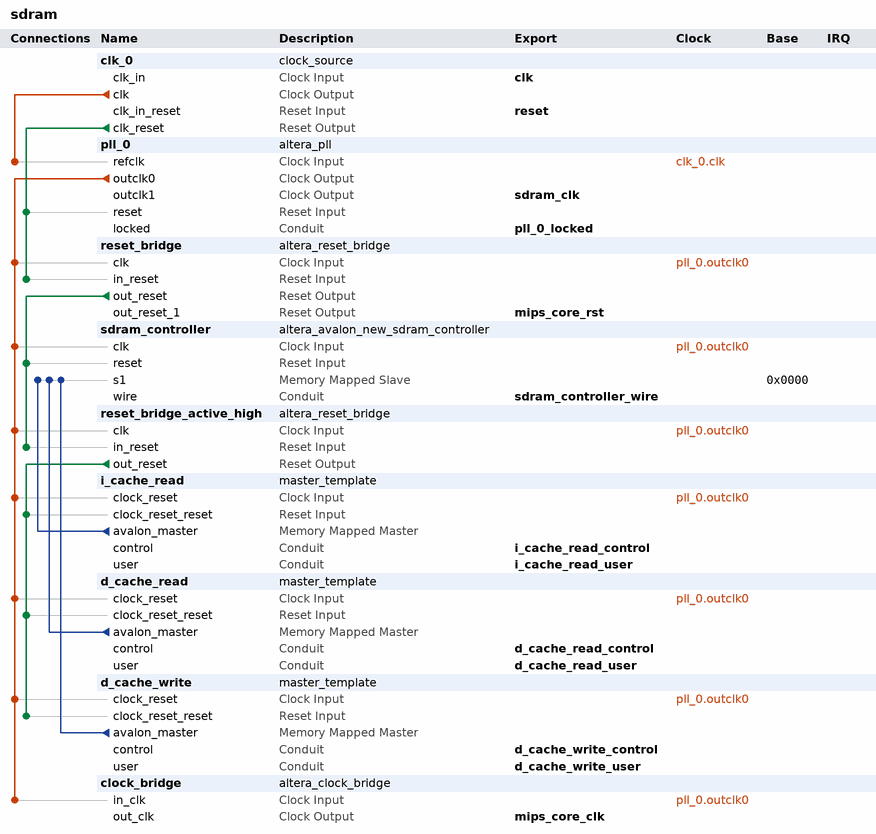
[diagram p0: system contents]
# Platform Designer (Qsys) system sdram, Cyclone V 5CSEMA5F31C6
# Parameters at their usual value, and those the tool derives, are not listed.
package require -exact qsys 19.1
create_system sdram
set_project_property DEVICE_FAMILY {Cyclone V}
set_project_property DEVICE 5CSEMA5F31C6

add_instance clk_0 clock_source 19.1
set_instance_parameter_value clk_0 clockFrequency 50000000

add_instance pll_0 altera_pll 19.1
set_instance_parameter_value pll_0 gui_actual_phase_shift1 {-3059 ps}
set_instance_parameter_value pll_0 gui_device_speed_grade 2
set_instance_parameter_value pll_0 gui_number_of_clocks 2
set_instance_parameter_value pll_0 gui_operation_mode normal
set_instance_parameter_value pll_0 gui_output_clock_frequency0 100.0
set_instance_parameter_value pll_0 gui_output_clock_frequency1 100.0
set_instance_parameter_value pll_0 gui_pll_mode {Integer-N PLL}
set_instance_parameter_value pll_0 gui_reference_clock_frequency 50.0
set_instance_parameter_value pll_0 gui_use_locked true

add_instance reset_bridge altera_reset_bridge 19.1
set_instance_parameter_value reset_bridge ACTIVE_LOW_RESET 1
set_instance_parameter_value reset_bridge NUM_RESET_OUTPUTS 2
set_instance_parameter_value reset_bridge SYNCHRONOUS_EDGES deassert

add_instance sdram_controller altera_avalon_new_sdram_controller 19.1
set_instance_parameter_value sdram_controller TAC 5.4
set_instance_parameter_value sdram_controller TRCD 15.0
set_instance_parameter_value sdram_controller TRP 15.0
set_instance_parameter_value sdram_controller casLatency 3
set_instance_parameter_value sdram_controller columnWidth 10
set_instance_parameter_value sdram_controller dataWidth 16
set_instance_parameter_value sdram_controller generateSimulationModel true
set_instance_parameter_value sdram_controller model single_Micron_MT48LC4M32B2_7_chip
set_instance_parameter_value sdram_controller numberOfBanks 4
set_instance_parameter_value sdram_controller numberOfChipSelects 1
set_instance_parameter_value sdram_controller powerUpDelay 1.0
set_instance_parameter_value sdram_controller refreshPeriod 7.8125
set_instance_parameter_value sdram_controller rowWidth 13

add_instance reset_bridge_active_high altera_reset_bridge 19.1
set_instance_parameter_value reset_bridge_active_high ACTIVE_LOW_RESET 0
set_instance_parameter_value reset_bridge_active_high SYNCHRONOUS_EDGES deassert

add_instance i_cache_read master_template 1.0
set_instance_parameter_value i_cache_read ADDRESS_WIDTH 26
set_instance_parameter_value i_cache_read BURST_CAPABLE 0
set_instance_parameter_value i_cache_read DATA_WIDTH 32
set_instance_parameter_value i_cache_read FIFO_DEPTH 32
set_instance_parameter_value i_cache_read MASTER_DIRECTION 0
set_instance_parameter_value i_cache_read MAXIMUM_BURST_COUNT 2
set_instance_parameter_value i_cache_read MEMORY_BASED_FIFO 1

add_instance d_cache_read master_template 1.0
set_instance_parameter_value d_cache_read ADDRESS_WIDTH 26
set_instance_parameter_value d_cache_read BURST_CAPABLE 0
set_instance_parameter_value d_cache_read DATA_WIDTH 32
set_instance_parameter_value d_cache_read FIFO_DEPTH 32
set_instance_parameter_value d_cache_read MASTER_DIRECTION 0
set_instance_parameter_value d_cache_read MAXIMUM_BURST_COUNT 2
set_instance_parameter_value d_cache_read MEMORY_BASED_FIFO 1

add_instance d_cache_write master_template 1.0
set_instance_parameter_value d_cache_write ADDRESS_WIDTH 26
set_instance_parameter_value d_cache_write BURST_CAPABLE 0
set_instance_parameter_value d_cache_write DATA_WIDTH 32
set_instance_parameter_value d_cache_write FIFO_DEPTH 32
set_instance_parameter_value d_cache_write MASTER_DIRECTION 1
set_instance_parameter_value d_cache_write MAXIMUM_BURST_COUNT 2
set_instance_parameter_value d_cache_write MEMORY_BASED_FIFO 1

add_instance clock_bridge altera_clock_bridge 19.1
set_instance_parameter_value clock_bridge DERIVED_CLOCK_RATE 100000000
set_instance_parameter_value clock_bridge EXPLICIT_CLOCK_RATE 0

# connections
add_connection clk_0.clk pll_0.refclk clock
add_connection pll_0.outclk0 clock_bridge.in_clk clock
add_connection pll_0.outclk0 d_cache_read.clock_reset clock
add_connection pll_0.outclk0 d_cache_write.clock_reset clock
add_connection pll_0.outclk0 i_cache_read.clock_reset clock
add_connection pll_0.outclk0 reset_bridge.clk clock
add_connection pll_0.outclk0 reset_bridge_active_high.clk clock
add_connection pll_0.outclk0 sdram_controller.clk clock
add_connection clk_0.clk_reset pll_0.reset reset
add_connection clk_0.clk_reset reset_bridge.in_reset reset
add_connection reset_bridge.out_reset reset_bridge_active_high.in_reset reset
add_connection reset_bridge.out_reset sdram_controller.reset reset
add_connection reset_bridge_active_high.out_reset d_cache_read.clock_reset_reset reset
add_connection reset_bridge_active_high.out_reset d_cache_write.clock_reset_reset reset
add_connection reset_bridge_active_high.out_reset i_cache_read.clock_reset_reset reset
add_connection d_cache_read.avalon_master sdram_controller.s1 avalon
set_connection_parameter_value d_cache_read.avalon_master/sdram_controller.s1 baseAddress 0x0000
add_connection d_cache_write.avalon_master sdram_controller.s1 avalon
set_connection_parameter_value d_cache_write.avalon_master/sdram_controller.s1 baseAddress 0x0000
add_connection i_cache_read.avalon_master sdram_controller.s1 avalon
set_connection_parameter_value i_cache_read.avalon_master/sdram_controller.s1 baseAddress 0x0000

# exported interfaces
add_interface clk clock sink
set_interface_property clk EXPORT_OF clk_0.clk_in
add_interface d_cache_read_control conduit end
set_interface_property d_cache_read_control EXPORT_OF d_cache_read.control
add_interface d_cache_read_user conduit end
set_interface_property d_cache_read_user EXPORT_OF d_cache_read.user
add_interface d_cache_write_control conduit end
set_interface_property d_cache_write_control EXPORT_OF d_cache_write.control
add_interface d_cache_write_user conduit end
set_interface_property d_cache_write_user EXPORT_OF d_cache_write.user
add_interface i_cache_read_control conduit end
set_interface_property i_cache_read_control EXPORT_OF i_cache_read.control
add_interface i_cache_read_user conduit end
set_interface_property i_cache_read_user EXPORT_OF i_cache_read.user
add_interface mips_core_clk clock source
set_interface_property mips_core_clk EXPORT_OF clock_bridge.out_clk
add_interface mips_core_rst reset source
set_interface_property mips_core_rst EXPORT_OF reset_bridge.out_reset_1
add_interface pll_0_locked conduit end
set_interface_property pll_0_locked EXPORT_OF pll_0.locked
add_interface reset reset sink
set_interface_property reset EXPORT_OF clk_0.clk_in_reset
add_interface sdram_clk clock source
set_interface_property sdram_clk EXPORT_OF pll_0.outclk1
add_interface sdram_controller_wire conduit end
set_interface_property sdram_controller_wire EXPORT_OF sdram_controller.wire

set_interconnect_requirement {$system} qsys_mm.clockCrossingAdapter HANDSHAKE
set_interconnect_requirement {$system} qsys_mm.enableEccProtection FALSE
set_interconnect_requirement {$system} qsys_mm.insertDefaultSlave FALSE
set_interconnect_requirement {$system} qsys_mm.maxAdditionalLatency 1

save_system sdram.qsys
